# EasyEDA schematic schematic.json
TITLE: Sheet_1; REV: 1.0; Date: 2024-11-24; Sheet: 1/1; Drawn By: phoenixpixel07; Company: Your Company
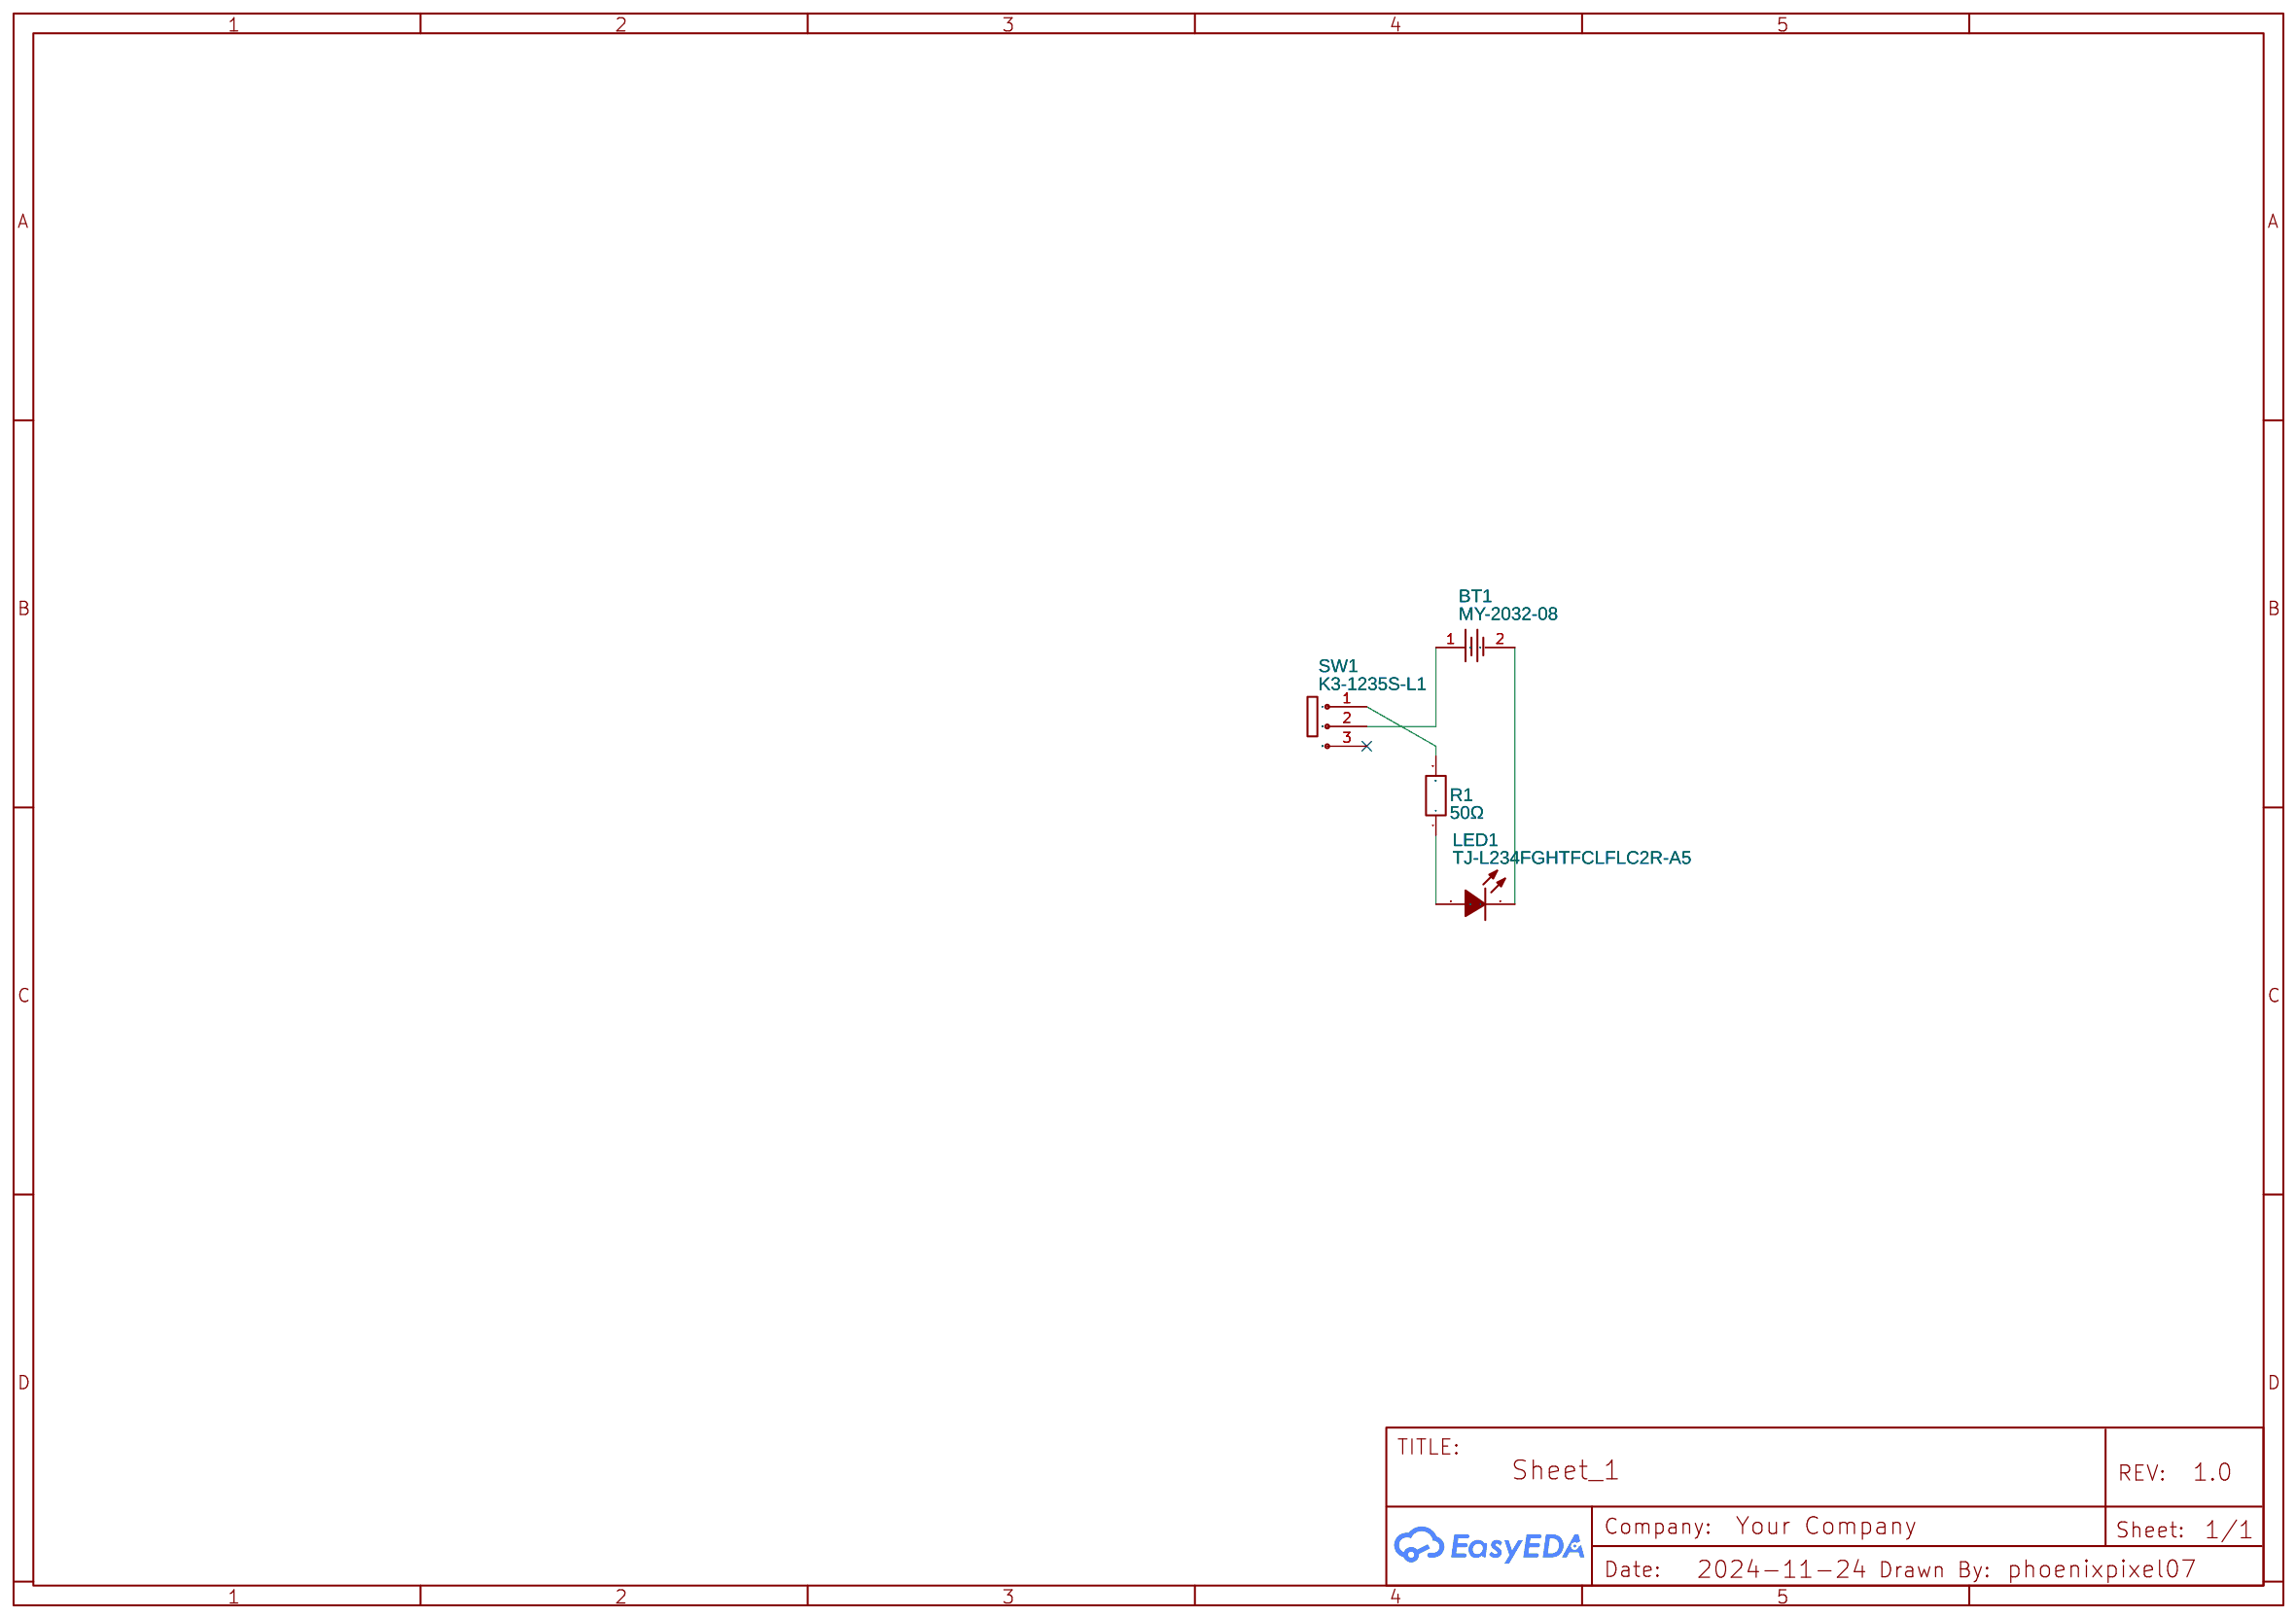
[diagram p0: schematic sheet]

## Parts
BT1  MY-2032-08  [BAT-SMD_MY-2032-08]
LED1  TJ-L234FGHTFCLFLC2R-A5  [LED-TH_L3.2-W2.0-P2.54-FD]
R1  50Ω  [R2010]
SW1  K3-1235S-L1  [SW-TH_K3-1235S-L1]

## Library data of the parts
BT1 = MY-2032-08: Contributor: LCSC; Supplier: LCSC; Supplier Part: C964831; Manufacturer: MYOUNG(美阳); JLCPCB Part Class: Extended Part
LED1 = TJ-L234FGHTFCLFLC2R-A5: Contributor: LCSC; Supplier: LCSC; Supplier Part: C440395; Manufacturer: TOGIALED(统佳); JLCPCB Part Class: Extended Part
R1 = AR10FTCO0500: Supplier: LCSC; Supplier Part: C3294591; Manufacturer: Viking(光颉); Contributor: lcsc; JLCPCB Part Class: Extended Part
SW1 = K3-1235S-L1: Contributor: LCSC; Supplier: LCSC; Supplier Part: C223838; Manufacturer: 韩国韩荣; JLCPCB Part Class: Extended Part

## Nets
Net-(BT1-1): BT1.1 SW1.2
Net-(BT1-2): BT1.2 LED1.2(K)
Net-(LED1-1): LED1.1(A) R1.1
Net-(R1-2): R1.2 SW1.1

Not connected (* = marked no-connect by the designer): SW1 3*
